# Altium schematic sheet pca10184_nrf54lm20.SchDoc: =ProductName + ' - nRF54LM20 MCU'
size A3; Organization: Nordic Semiconductor; DocumentNumber: 2; SheetNumber: 2; SheetTotal: 9; CompanyName: Nordic Semiconductor; DocumentSize: A3
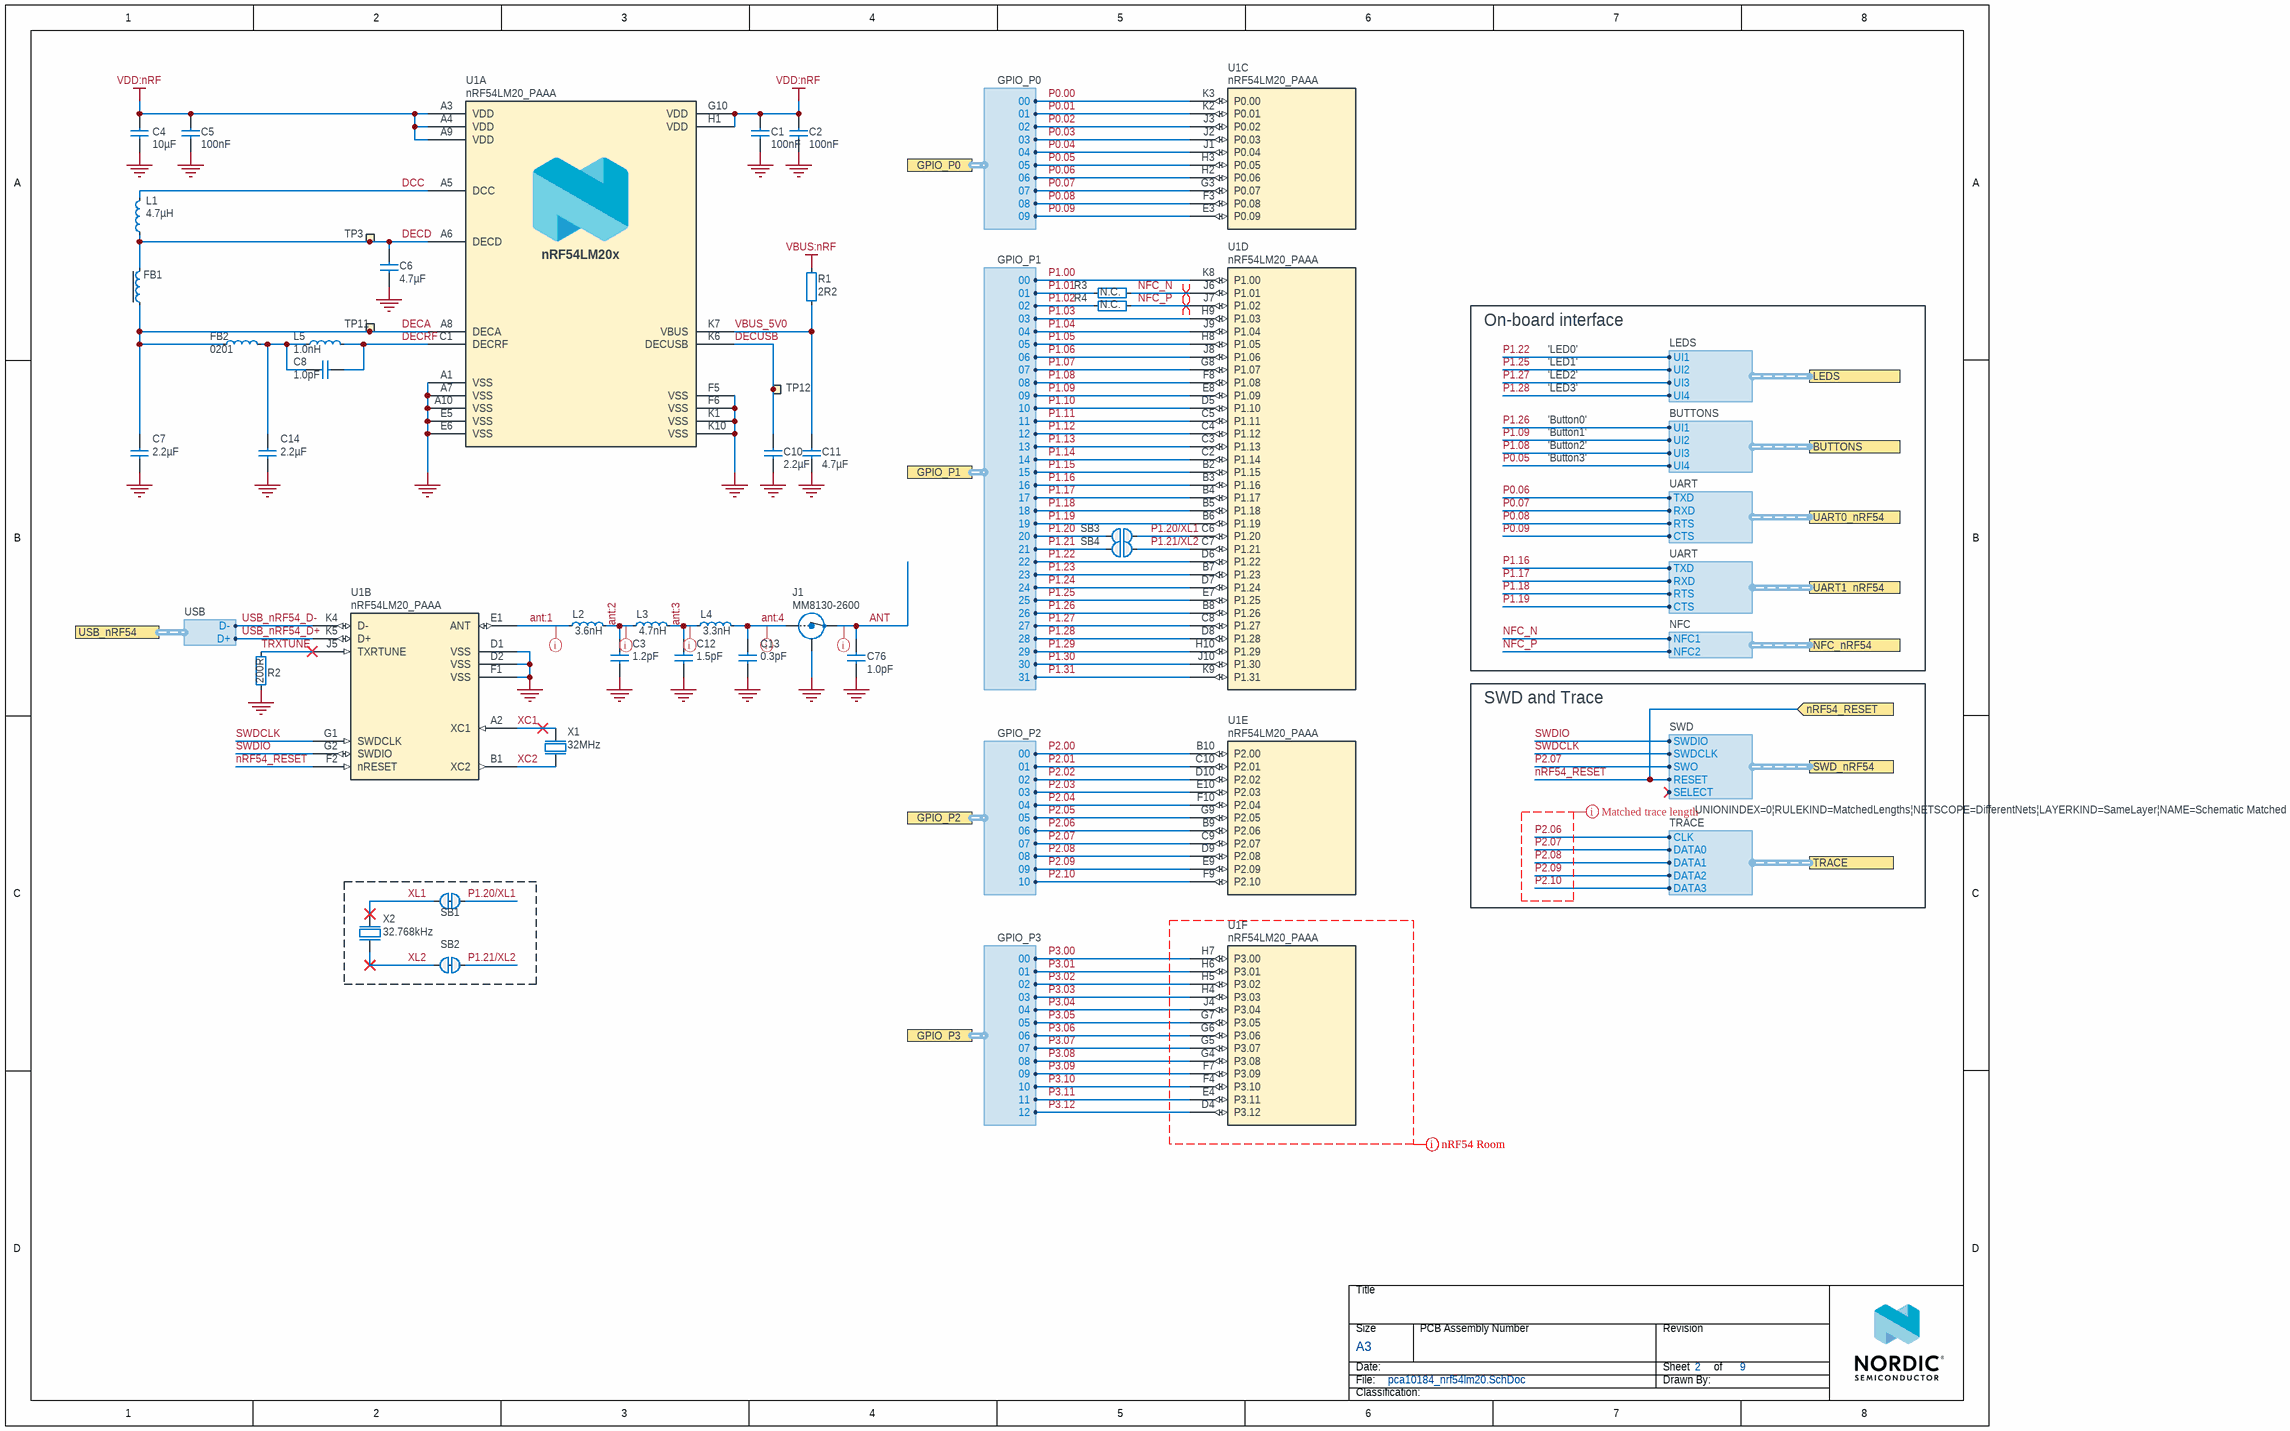
[diagram p0: pca10184_nrf54lm20.SchDoc]

## Parts
C1  100nF  [CAPC0603X03L_C]
C2  100nF  [CAPC0603X03L_C]
C3  1.2pF  [CAPC0603X03L_C]
C4  10µF  [CAPC1005X04L]
C5  100nF  [CAPC0603X03L_C]
C6  4.7µF  [CAPC0603X03L_C]
C7  2.2µF  [CAPC0603X03L_C]
C8  1.0pF  [CAPC0603X03L_C]
C10  2.2µF  [CAPC0603X03L_C]
C11  4.7µF  [CAPC1005X04L]
C12  1.5pF  [CAPC0603X03L_C]
C13  0.3pF  [CAPC0603X03L_C]
C14  2.2µF  [CAPC0603X03L_C]
C76  1.0pF  [CAPC0603X03L_C]
FB1  120R/0.2A  [INDC0603X03L_C]  (value not drawn)
FB2  Footprint Doc: 0201  [INDC0603X03L_C]  (hidden comment: 15nH)
J1  MM8130-2600  [COAXIAL-SWF]
L1  4.7µH  [INDC1608X06L]
L2  3.6nH  [INDC0603X03L_C]
L3  4.7nH  [INDC0603X03L_C]
L4  3.3nH  [INDC0603X03L_C]
L5  1.0nH  [INDC0603X03L_C]
R1  2R2  [RESC1608X06L]
R2  200R  [RESC0603X03L_C]
R3  N.C.  [RESC1005X04L_NC]
R4  N.C.  [RESC1005X04L_NC]
SB1  Solderbridge  [Solderbridge_Shorted]  (value not drawn)  (net tie, no BOM)
SB2  Solderbridge  [Solderbridge_Shorted]  (value not drawn)  (net tie, no BOM)
SB3  Solderbridge  [Solderbridge]  (value not drawn)  (no BOM)
SB4  Solderbridge  [Solderbridge]  (value not drawn)  (no BOM)
TP3  Ø0.7mm,SMD  [TP_SMD_D0.7mm]  (value not drawn)  (no BOM)
TP11  Ø0.7mm,SMD  [TP_SMD_D0.7mm]  (value not drawn)  (no BOM)
TP12  Ø0.7mm,SMD  [TP_SMD_D0.7mm]  (value not drawn)  (no BOM)
U1  nRF54LM20_PAAA  [BGA98C35P10X10_367X385X86]  (parts A,B,C,D,E,F of 6)
X1  32MHz  [BT-XTAL_2016]
X2  32.768kHz  [XTAL_2012]

## Ports
BUTTONS (harness BUTTONS), GPIO_P0 (harness GPIO_P0), GPIO_P1 (harness GPIO_P1), GPIO_P2 (harness GPIO_P2), GPIO_P3 (harness GPIO_P3), LEDS (harness LEDS), NFC_nRF54 (harness NFC), nRF54_RESET (in), SWD_nRF54 (harness SWD), TRACE (harness TRACE), UART0_nRF54 (harness UART), UART1_nRF54 (harness UART), USB_nRF54 (harness USB)

## Harnesses
GPIO_P0: 00, 01, 02, 03, 04, 05, 06, 07, 08, 09
GPIO_P1: 00, 01, 02, 03, 04, 05, 06, 07, 08, 09, 10, 11, 12, 13, 14, 15, 16, 17, 18, 19, 20, 21, 22, 23, 24, 25, 26, 27, 28, 29, 30, 31
GPIO_P2: 00, 01, 02, 03, 04, 05, 06, 07, 08, 09, 10
GPIO_P3: 00, 01, 02, 03, 04, 05, 06, 07, 08, 09, 10, 11, 12
USB: D+, D-
NFC: NFC2, NFC1
UART: RTS, CTS, RXD, TXD
LEDS: UI2, UI1, UI3, UI4
BUTTONS: UI2, UI1, UI3, UI4
SWD: SWDIO, SWDCLK, SWO, RESET, SELECT
TRACE: CLK, DATA0, DATA1, DATA3, DATA2

## Nets
GND: C1.2 C2.2 C3.1 C4.1 C5.2 C6.1 C7.1 C10.1 C11.1 C12.2 C13.1 C14.1 C76.1 J1.2(Shield) R2.1 U1.A1(VSS) U1.A7(VSS) U1.A10(VSS) U1.D1(VSS) U1.D2(VSS) U1.E5(VSS) U1.E6(VSS) U1.F1(VSS) U1.F5(VSS) U1.F6(VSS) U1.K1(VSS) U1.K10(VSS) X1.2(GND) X1.4(GND)
VBUS:nRF: R1.2
VDD:nRF: C1.1 C2.1 C4.2 C5.1 U1.A3(VDD) U1.A4(VDD) U1.A9(VDD) U1.G10(VDD) U1.H1(VDD)
ANT: C76.2 J1.3(OUT)
ant:1: L2.1 U1.E1(ANT)
ant:2: C3.2 L2.2 L3.1
ant:3: C12.1 L3.2 L4.1
ant:4: C13.2 J1.1(IN) L4.2
DCC: L1.1 U1.A5(DCC)
DECA: C7.2 FB1.2 FB2.2 TP11.1 U1.A8(DECA)
DECD: C6.2 FB1.1 L1.2 TP3.1 U1.A6(DECD)
DECRF: C8.1 L5.2 U1.C1(DECRF)
DECUSB: C10.2 TP12.1 U1.K6(DECUSB)
NFC_N: R3.2 U1.J6(P1.01) ; port NFC_nRF54.NFC1
NFC_P: R4.2 U1.J7(P1.02) ; port NFC_nRF54.NFC2
nRF54_RESET: U1.F2(nRESET) ; port nRF54_RESET, port SWD_nRF54.RESET
P0.00: U1.K3(P0.00) ; port GPIO_P0.00
P0.01: U1.K2(P0.01) ; port GPIO_P0.01
P0.02: U1.J3(P0.02) ; port GPIO_P0.02
P0.03: U1.J2(P0.03) ; port GPIO_P0.03
P0.04: U1.J1(P0.04) ; port GPIO_P0.04
P0.05: U1.H3(P0.05) ; port GPIO_P0.05, port BUTTONS.UI4
P0.06: U1.H2(P0.06) ; port GPIO_P0.06, port UART0_nRF54.TXD
P0.07: U1.G3(P0.07) ; port GPIO_P0.07, port UART0_nRF54.RXD
P0.08: U1.F3(P0.08) ; port GPIO_P0.08, port UART0_nRF54.RTS
P0.09: U1.E3(P0.09) ; port GPIO_P0.09, port UART0_nRF54.CTS
P1.00: U1.K8(P1.00) ; port GPIO_P1.00
P1.01: R3.1 ; port GPIO_P1.01
P1.02: R4.1 ; port GPIO_P1.02
P1.03: U1.H9(P1.03) ; port GPIO_P1.03
P1.04: U1.J9(P1.04) ; port GPIO_P1.04
P1.05: U1.H8(P1.05) ; port GPIO_P1.05
P1.06: U1.J8(P1.06) ; port GPIO_P1.06
P1.07: U1.G8(P1.07) ; port GPIO_P1.07
P1.08: U1.F8(P1.08) ; port GPIO_P1.08, port BUTTONS.UI3
P1.09: U1.E8(P1.09) ; port GPIO_P1.09, port BUTTONS.UI2
P1.10: U1.D5(P1.10) ; port GPIO_P1.10
P1.11: U1.C5(P1.11) ; port GPIO_P1.11
P1.12: U1.C4(P1.12) ; port GPIO_P1.12
P1.13: U1.C3(P1.13) ; port GPIO_P1.13
P1.14: U1.C2(P1.14) ; port GPIO_P1.14
P1.15: U1.B2(P1.15) ; port GPIO_P1.15
P1.16: U1.B3(P1.16) ; port GPIO_P1.16, port UART1_nRF54.TXD
P1.17: U1.B4(P1.17) ; port GPIO_P1.17, port UART1_nRF54.RXD
P1.18: U1.B5(P1.18) ; port GPIO_P1.18, port UART1_nRF54.RTS
P1.19: U1.B6(P1.19) ; port GPIO_P1.19, port UART1_nRF54.CTS
P1.20: SB3.2 ; port GPIO_P1.20
P1.20/XL1: SB1.1 SB3.1 U1.C6(P1.20)
P1.21: SB4.2 ; port GPIO_P1.21
P1.21/XL2: SB2.1 SB4.1 U1.C7(P1.21)
P1.22: U1.D6(P1.22) ; port GPIO_P1.22, port LEDS.UI1
P1.23: U1.B7(P1.23) ; port GPIO_P1.23
P1.24: U1.D7(P1.24) ; port GPIO_P1.24
P1.25: U1.E7(P1.25) ; port GPIO_P1.25, port LEDS.UI2
P1.26: U1.B8(P1.26) ; port GPIO_P1.26, port BUTTONS.UI1
P1.27: U1.C8(P1.27) ; port GPIO_P1.27, port LEDS.UI3
P1.28: U1.D8(P1.28) ; port GPIO_P1.28, port LEDS.UI4
P1.29: U1.H10(P1.29) ; port GPIO_P1.29
P1.30: U1.J10(P1.30) ; port GPIO_P1.30
P1.31: U1.K9(P1.31) ; port GPIO_P1.31
P2.00: U1.B10(P2.00) ; port GPIO_P2.00
P2.01: U1.C10(P2.01) ; port GPIO_P2.01
P2.02: U1.D10(P2.02) ; port GPIO_P2.02
P2.03: U1.E10(P2.03) ; port GPIO_P2.03
P2.04: U1.F10(P2.04) ; port GPIO_P2.04
P2.05: U1.G9(P2.05) ; port GPIO_P2.05
P2.06: U1.B9(P2.06) ; port GPIO_P2.06, port TRACE.CLK
P2.07: U1.C9(P2.07) ; port GPIO_P2.07, port SWD_nRF54.SWO, port TRACE.DATA0
P2.08: U1.D9(P2.08) ; port GPIO_P2.08, port TRACE.DATA1
P2.09: U1.E9(P2.09) ; port GPIO_P2.09, port TRACE.DATA2
P2.10: U1.F9(P2.10) ; port GPIO_P2.10, port TRACE.DATA3
P3.00: U1.H7(P3.00) ; port GPIO_P3.00
P3.01: U1.H6(P3.01) ; port GPIO_P3.01
P3.02: U1.H5(P3.02) ; port GPIO_P3.02
P3.03: U1.H4(P3.03) ; port GPIO_P3.03
P3.04: U1.J4(P3.04) ; port GPIO_P3.04
P3.05: U1.G7(P3.05) ; port GPIO_P3.05
P3.06: U1.G6(P3.06) ; port GPIO_P3.06
P3.07: U1.G5(P3.07) ; port GPIO_P3.07
P3.08: U1.G4(P3.08) ; port GPIO_P3.08
P3.09: U1.F7(P3.09) ; port GPIO_P3.09
P3.10: U1.F4(P3.10) ; port GPIO_P3.10
P3.11: U1.E4(P3.11) ; port GPIO_P3.11
P3.12: U1.D4(P3.12) ; port GPIO_P3.12
SWDCLK: U1.G1(SWDCLK) ; port SWD_nRF54.SWDCLK
SWDIO: U1.G2(SWDIO) ; port SWD_nRF54.SWDIO
TRXTUNE: R2.2 U1.J5(TXRTUNE)
USB_nRF54_D+: U1.K5(D+) ; port USB_nRF54.D+
USB_nRF54_D-: U1.K4(D-) ; port USB_nRF54.D-
VBUS_5V0: C11.2 R1.1 U1.K7(VBUS)
XC1: U1.A2(XC1) X1.1(inp)
XC2: U1.B1(XC2) X1.3(out)
XL1: SB1.2 X2.2(out)
XL2: SB2.2 X2.1(inp)
NetC8_2: C8.2 C14.2 FB2.1 L5.1

## Layout directives
differential pair; differential pair class NFC: NFC_N, NFC_P
net class TRACE; rule Matched Net Lengths [Delay Tolerance = 500ps]: P2.06, P2.07, P2.08, P2.09, P2.10
net class RF: ANT, ant:1, ant:2, ant:3, ant:4
CompClassName: nRF54: (no net found under the mark)

## Notes on the sheet
- On-board interface
- 'LED0'
- 'LED1'
- 'LED2'
- 'LED3'
- 'Button0'
- 'Button1'
- 'Button2'
- 'Button3'
- SWD and Trace
- Title
- Size
- Date:
- File:
- A3
- PCB Assembly Number
- Sheet
- Drawn By:
- Revision
- of
- Classification:
- (in symbol nRF54LM20-PAAA, part A) nRF54LM20x

## Library data of the parts
C1 C2 C5 = C0201-100n-10V-X7R: Capacitor, X7R, ±10%, 10V; Manufacturer: N.A.; Part number NEMS: 100200469; Pad Count: 2; Component Status: Active; Part Number: C0201-100n-10V-X7R; Manufacturer Part Number: N.A.; Footprint Doc: 0201; LatestRevisionDate: 2024-09-18; Published: 2021-04-12; Value: 100nF; Note: 10V; Artikkelnr Noca: N.A.; Part number IPS: N.A.; ComponentLink1URL: N.A.; ComponentLink1Description: Datasheet; ComponentLink2URL: N.A.; ComponentLink2Description: Supplier link; HelpURL: N.A.; Supplier 1: N.A.; Supplier Part Number 1: N.A.; Supplier 2: N.A.; Supplier Part Number 2: N.A.; Component Class: Capacitors; Author: getr; Part number Norautron: N.A.; PartId: 100200469
C3 = C0201-1.2p-HQ-Murata: Capacitor, NP0, ±0.05pF, 50V; Manufacturer: Murata; Manufacturer Part Number: GJM0335C1H1R2WB01D; Part number NEMS: 100200457; Component Status: Active; Pad Count: 2; Artikkelnr Noca: N.A.; Part Number: C0201-1.2p-HQ-Murata; Component Class: Capacitors; Author: rsk; ComponentLink1URL: https://search.murata.co.jp/Ceramy/image/img/A01X/G101/ENG/GJM0335C1H1R2WB01-01.pdf; ComponentLink1Description: Datasheet; ComponentLink2URL: https://www.murata.com/en-global/products/productdetail?partno=GJM0335C1H1R2WB01%23; ComponentLink2Description: Supplier link; HelpURL: N.A.; LatestRevisionDate: 2020-12-16; Published: 2020-12-16; Footprint Doc: 0201; Value: 1.2pF; Note: 50V; Supplier 1: DigiKey; Supplier Part Number 1: 490-GJM0335C1H1R2WB01DCT-ND; Supplier 2: Mouser; Supplier Part Number 2: 81-GJM0335C1H1R2WB1D; Part number IPS: N.A.; Part number Norautron: N.A.; PartId: 100200457
C4 = C0402-10µF-6.3V-X6S: Capacitor, X6S, ±20%, 6.3V; Manufacturer: N.A.; Part number NEMS: 100200478; Component Status: Active; Pad Count: 2; Part Number: C0402-10µF-6.3V-X6S; PartId: 100200478; Component Class: Capacitors; Author: getr; Manufacturer Part Number: N.A.; ComponentLink1URL: N.A.; ComponentLink1Description: Datasheet; ComponentLink2URL: N.A.; ComponentLink2Description: Supplier link; HelpURL: N.A.; LatestRevisionDate: 2021-06-25; Published: 2021-06-25; Footprint Doc: 0402; Value: 10µF; Note: 6.3V; Supplier 1: N.A.; Supplier Part Number 1: N.A.; Supplier 2: N.A.; Supplier Part Number 2: N.A.; Artikkelnr Noca: N.A.; Part number IPS: N.A.; Part number Norautron: N.A.
C6 = C0201-4.7µ-6V3-X5R-GRM035R60J475ME15J: Capacitor, Ceramic, X5R, ±20%, 6.3V; Manufacturer: Murata; Part number NEMS: 100200685; Component Status: Active; Pad Count: 2; Note: -55°C ~ 85°C; Artikkelnr Noca: N.A.; Part Number: C0201-4.7µ-6V3-X5R-GRM035R60J475ME15J; Component Class: Capacitors; Author: rsk; Manufacturer Part Number: GRM035R60J475ME15J; ComponentLink1URL: https://search.murata.co.jp/Ceramy/image/img/A01X/G101/ENG/GRM035R60J475ME15-01A.pdf; ComponentLink1Description: Datasheet; ComponentLink2URL: https://www.digikey.no/en/products/detail/murata-electronics/GRM035R60J475ME15J/10699045; ComponentLink2Description: Supplier link; HelpURL: https://www.murata.com/en-eu/products/productdetail?partno=GRM035R60J475ME15J; LatestRevisionDate: 2025-03-04; Published: 2025-03-04; Footprint Doc: 0201; Value: 4.7µF; Supplier 1: DigiKey; Supplier Part Number 1: 490-GRM035R60J475ME15JDKR-ND; Supplier 2: Mouser; Supplier Part Number 2: 81-GRM035R60J475ME5J; Part number IPS: N.A.; Part number Norautron: N.A.; PartId: 100200685
C7 C14 = C0201-2µ2-2.5V-X6T-GRM033D80E225ME47D: Capacitor, Ceramic, 2.2µF 2.5V X6T 0201,±20%; Manufacturer: Murata; Part number NEMS: 100200527; Component Status: Active; Pad Count: 2; Note: 2.5V, 20%, X6T; Artikkelnr Noca: N.A.; Part Number: C0201-2µ2-2.5V-X6T-GRM033D80E225ME47D; Component Class: Capacitors; Author: stl1; Manufacturer Part Number: GRM033D80E225ME47D; ComponentLink1URL: https://www.murata.com/products/productdetail?partno=GRM033D80E225ME47%23; ComponentLink1Description: Datasheet; ComponentLink2URL: N.A.; ComponentLink2Description: Supplier link; HelpURL: N.A.; LatestRevisionDate: 2022-02-27; Published: 2022-02-27; Footprint Doc: 0201; Value: 2.2µF; Supplier 1: Mouser; Supplier Part Number 1: 81-GRM033D80E225ME7D; Supplier 2: DigiKey; Supplier Part Number 2: 490-18653-1-ND; Part number IPS: N.A.; Part number Norautron: N.A.; PartId: 100200527
C8 = C0201-1p0-25V-COG-GJM0335C1E1R0WB01: CAP CER 1.0PF 25V C0G/NP0 0201; Manufacturer: Murata; Part number NEMS: 100200676; Component Status: Active; Pad Count: 2; Artikkelnr Noca: N.A.; Part Number: C0201-1p0-25V-COG-GJM0335C1E1R0WB01; Component Class: Capacitors; Author: masi; Manufacturer Part Number: GJM0335C1E1R0WB01; ComponentLink1URL: https://search.murata.co.jp/Ceramy/image/img/A01X/G101/ENG/GJM0335C1E1R0WB01-01A.pdf; ComponentLink1Description: Datasheet; ComponentLink2URL: https://www.digikey.no/en/products/detail/murata-electronics/GRM0335C1E101JA01D/702426?s=N4IgTCBcDaICwE4AMBaAzARgGyqygcgCIgC6AvkA; ComponentLink2Description: Supplier link; HelpURL: N.A.; LatestRevisionDate: 2024-10-17; Published: 2024-10-17; Footprint Doc: 0201; Value: 1.0pF; Note: 25V; Supplier 1: DigiKey; Supplier Part Number 1: 490-10677-1-ND; Supplier 2: Mouser; Supplier Part Number 2: 81-GJM0335C1E1R0WB01; Part number IPS: N.A.; Part number Norautron: N.A.; PartId: 100200676
C10 = C0201-2µ2-10V-X5R-GRM033R61A225KE47: Capacitor, Ceramic, 2.2µF 10V X5R 0201,±10%; Manufacturer: Murata; Manufacturer Part Number: GRM033R61A225KE47D; Part number NEMS: 100200496; Component Status: Active; Pad Count: 2; Artikkelnr Noca: N.A.; Part Number: C0201-2µ2-10V-X5R-GRM033R61A225KE47; Component Class: Capacitors; Author: prbu; ComponentLink1URL: https://www.murata.com/en-sg/products/productdetail?partno=GRM033R61A225KE47%23; ComponentLink1Description: Datasheet; ComponentLink2URL: https://www.mouser.com/ProductDetail/Murata-Electronics/GRM033R61A225KE47D?qs=I53XXhTNm8tqgHaFsI1bug%3D%3D; ComponentLink2Description: Supplier link; HelpURL: N.A.; LatestRevisionDate: 2021-12-09; Published: 2021-12-09; Footprint Doc: 0201; Value: 2.2µF; Note: 10V; Supplier 1: Mouser; Supplier Part Number 1: 81-GRM033R61A225KE7D; Supplier 2: Digi-Key; Supplier Part Number 2: 490-13227-1-ND; Part number IPS: N.A.; Part number Norautron: N.A.; PartId: 100200496
C11 = C0402-4µ7-10V-X5R: Capacitor, X5R, 10V; Manufacturer: Murata; Manufacturer Part Number: GRM155R61A475MEAAD; Part number NEMS: 100200415; Component Status: Active; Pad Count: 2; Artikkelnr Noca: N.A.; Part Number: C0402-4µ7-10V-X5R; PartId: 100200415; Component Class: Capacitors; Author: rsk; ComponentLink1URL: http://search.murata.co.jp/Ceramy/image/img/A01X/G101/ENG/GRM155R61A475MEAA-01.pdf; ComponentLink1Description: Datasheet; ComponentLink2URL: https://www.digikey.com/product-detail/en/murata-electronics-north-america/GRM155R61A475MEAAD/490-14306-1-ND/6234742; ComponentLink2Description: Supplier link; HelpURL: https://psearch.en.murata.com/capacitor/product/GRM155R61A475MEAA%23.html; LatestRevisionDate: 2020-10-13; Published: 2018-10-04; Footprint Doc: 0402; Value: 4.7µF; Note: 10V; Supplier 1: Digi-Key; Supplier Part Number 1: 490-14306-1-ND; Supplier 2: N.A.; Supplier Part Number 2: N.A.; Part number IPS: N.A.; Part number Norautron: N.A.
C12 = C0201-1.5p-25V-NP0-GJM0335C1E1R5WB01: Capacitor, NP0, ±0.05pF, 25V, High Q; Manufacturer: Murata; Part number NEMS: 100200477; Component Status: Active; Pad Count: 2; Artikkelnr Noca: N.A.; Part Number: C0201-1.5p-25V-NP0-GJM0335C1E1R5WB01; Component Class: Capacitors; Author: masi; Manufacturer Part Number: GJM0335C1E1R5WB01; ComponentLink1URL: https://search.murata.co.jp/Ceramy/image/img/A01X/G101/ENG/GJM0335C1E1R5WB01-01.pdf; ComponentLink1Description: Datasheet; ComponentLink2URL: N.A.; ComponentLink2Description: Supplier link; HelpURL: https://www.murata.com/products/productdetail?partno=GJM0335C1E1R5WB01%23; LatestRevisionDate: 2021-06-15; Published: 2021-06-15; Footprint Doc: 0201; Value: 1.5pF; Note: 25V; Supplier 1: DigiKey; Supplier Part Number 1: 490-11176-2-ND; Supplier 2: Mouser; Supplier Part Number 2: 81-GJM0335C1E1R5WB1D; Part number IPS: N.A.; Part number Norautron: N.A.; PartId: 100200477
C13 = C0201-0.3p-50V-GRM0335C1HR30BA01: Capacitor, C0G, ±0.1pF, 50V; Manufacturer: Murata; Part number NEMS: 100200650; Component Status: Active; Pad Count: 2; Artikkelnr Noca: N.A.; Part Number: C0201-0.3p-50V-GRM0335C1HR30BA01; PartId: 100200650; Component Class: Capacitors; Author: masi; Manufacturer Part Number: GRM0335C1HR30BA01; ComponentLink1URL: https://www.murata.com/en-global/products/productdetail?partno=GRM0335C1HR30BA01%23; ComponentLink1Description: Datasheet; ComponentLink2URL: N.A.; ComponentLink2Description: Supplier link; HelpURL: N.A.; LatestRevisionDate: 2024-01-10; Published: 2024-01-10; Footprint Doc: 0201; Value: 0.3pF; Note: 50V; Supplier 1: DigiKey; Supplier Part Number 1: 490-6135-2-ND; Supplier 2: Mouser; Supplier Part Number 2: 81-GRM0335C1HR30BA1D; Part number IPS: N.A.; Part number Norautron: N.A.
C76 = C0201-1.0p_RF: RF Chip Cap 0201; Manufacturer: N.A.; Part number NEMS: 100200085; Pad Count: 2; Note: High frequency chip capasitors ±5%, NP0; Component Status: Active; Part Number: C0201-1.0p_RF; PartId: 100200085; Component Class: Capacitors; Author: rsk; Manufacturer Part Number: N.A.; ComponentLink1URL: N.A.; ComponentLink1Description: Datasheet; ComponentLink2URL: N.A.; ComponentLink2Description: Supplier link; HelpURL: N.A.; Footprint Doc: 0201; LatestRevisionDate: 2016-04-22; Published: 2016-04-22; Value: 1.0pF; Supplier 1: N.A.; Supplier Part Number 1: N.A.; Supplier 2: N.A.; Supplier Part Number 2: N.A.; Artikkelnr Noca: N.A.; Part number IPS: N.A.; Part number Norautron: N.A.
FB1 = FB0201-120R@100M-200mA-BLM03AG121SN1D: Ferrite Bead, 120 Ohm @ 100MHz, 200mA, 500 mOhm Max; Manufacturer: Murata; Part number NEMS: 100300419; Component Status: Active; Pad Count: 2; Artikkelnr Noca: N.A.; Part Number: FB0201-120R@100M-200mA-BLM03AG121SN1D; Component Class: Inductors; Author: stl1; Manufacturer Part Number: BLM03AG121SN1D; ComponentLink1URL: https://www.murata.com/en-eu/products/productdetail?partno=BLM03AG121SN1%23; ComponentLink1Description: Datasheet; ComponentLink2URL: N.A.; ComponentLink2Description: Supplier link; HelpURL: N.A.; LatestRevisionDate: 2022-02-27; Published: 2022-02-27; Footprint Doc: 0201; Value: 120R/0.2A; Note: Ferrite Bead; Supplier 1: Digi-Key; Supplier Part Number 1: 490-5622-1-ND; Supplier 2: Mouser; Supplier Part Number 2: 81-BLM03AX121SN1D; Part number IPS: N.A.; Part number Norautron: N.A.; PartId: 100300419
FB2 = L0201-15n: Inductor, 250mA, ±5%; Manufacturer: Murata; Manufacturer Part Number: LQP03TN15NJ02D; Part number NEMS: 100300032; Component Status: Active; Pad Count: 2; Note: High frequency chip inductor ±10%; Artikkelnr Noca: N.A.; Part Number: L0201-15n; Component Class: Inductors; Author: rsk; ComponentLink1URL: http://search.murata.co.jp/Ceramy/image/img/P02/JELF243C-0015.pdf; ComponentLink1Description: Datasheet; ComponentLink2URL: N.A.; ComponentLink2Description: Supplier link; HelpURL: N.A.; LatestRevisionDate: 2013-04-10; Published: 2013-04-10; Value: 15nH; Supplier 1: DigiKey; Supplier Part Number 1: 490-5570-1-ND; Supplier 2: N.A.; Supplier Part Number 2: N.A.; Part number IPS: N.A.; Part number Norautron: N.A.; PartId: 100300032
J1 = MM8130-2600: Coaxial Connector with Switch; Manufacturer: Murata; Part number IPS: 00000009955; Part number Norautron: 26030338; Part number NEMS: 100500400; Note: N.A.; Artikkelnr Noca: 55029011; Pad Count: 3; Component Status: Active; Part Number: MM8130-2600; Manufacturer Part Number: MM8130-2600; LatestRevisionDate: 2014-04-24; Published: 2014-04-24; Value: MM8130-2600; Footprint Doc: COAXIAL-SWF; ComponentLink1URL: N.A.; ComponentLink1Description: Datasheet; ComponentLink2URL: N.A.; ComponentLink2Description: Supplier link; HelpURL: http://www.murata.com/products/catalog/pdf/o33e.pdf; Supplier 1: Digi-Key; Supplier Part Number 1: 490-4981-1-ND; Supplier 2: Mouser; Supplier Part Number 2: 81-MM8130-2600RA2; Component Class: Connectors; PartId: 100500400; Author: rsk; System: Connector
L1 = L0603-4µ7-MLZ1608M4R7WT000: Inductor, 120mA, ±20%, 0.65R; Manufacturer: TDK Corporation; Part number NEMS: 100300440; Component Status: Active; Pad Count: 2; Note: Power Inductor ±20%; Artikkelnr Noca: N.A.; Part Number: L0603-4µ7-MLZ1608M4R7WT000; PartId: 100300440; Component Class: Inductors; Author: stl1; Manufacturer Part Number: MLZ1608M4R7WT000; ComponentLink1URL: https://product.tdk.com/en/search/inductor/inductor/smd/info?part_no=MLZ1608M4R7WT000; ComponentLink1Description: Datasheet; ComponentLink2URL: N.A.; ComponentLink2Description: Supplier link; HelpURL: N.A.; LatestRevisionDate: 2023-05-10; Published: 2023-05-10; Footprint Doc: 0603; Value: 4.7µH; Supplier 1: Digi-Key; Supplier Part Number 1: 445-6390-2-ND; Supplier 2: Mouser; Supplier Part Number 2: 810-MLZ1608M4R7WT000; Part number IPS: N.A.; Part number Norautron: N.A.
L2 = L0201-3n6-HQ-Murata: Inductor, 500mA, ±0.1ｎH, 170mOhm; Manufacturer: Murata; Manufacturer Part Number: LQP03HQ3N6B02; Part number NEMS: 100300223; Component Status: Active; Pad Count: 2; Note: -55°C ~ 125°C; Artikkelnr Noca: N.A.; Part Number: L0201-3n6-HQ-Murata; PartId: 100300223; Component Class: Inductors; Author: rsk; ComponentLink1URL: https://search.murata.co.jp/Ceramy/image/img/P02/JELF243C-0021.pdf; ComponentLink1Description: Datasheet; ComponentLink2URL: N.A.; ComponentLink2Description: Supplier link; HelpURL: https://psearch.en.murata.com/inductor/product/LQP03HQ3N6B02%23.html; LatestRevisionDate: 2018-10-23; Published: 2018-10-23; Footprint Doc: 0201; Value: 3.6nH; Supplier 1: DigiKey; Supplier Part Number 1: 490-13927-1-ND; Supplier 2: N.A.; Supplier Part Number 2: N.A.; Part number IPS: N.A.; Part number Norautron: N.A.
L3 = L0201-4n7-HQ-Murata: Inductor, 400mA, ±3%, 250mOhm; Manufacturer: Murata; Manufacturer Part Number: LQP03HQ4N7H02; Part number NEMS: 100300231; Component Status: Active; Pad Count: 2; Note: -55°C ~ 125°C; Artikkelnr Noca: N.A.; Part Number: L0201-4n7-HQ-Murata; Component Class: Inductors; Author: rsk; ComponentLink1URL: https://search.murata.co.jp/Ceramy/image/img/P02/JELF243C-0021.pdf; ComponentLink1Description: Datasheet; ComponentLink2URL: N.A.; ComponentLink2Description: Supplier link; HelpURL: https://psearch.en.murata.com/inductor/product/LQP03HQ4N7H02%23.html; LatestRevisionDate: 2018-10-23; Published: 2018-10-23; Footprint Doc: 0201; Value: 4.7nH; Supplier 1: DigiKey; Supplier Part Number 1: 490-13943-1-ND; Supplier 2: N.A.; Supplier Part Number 2: N.A.; Part number IPS: N.A.; Part number Norautron: N.A.; PartId: 100300231
L4 = L0201-3n3-HQ-Murata: Inductor, 500mA, ±0.1ｎH, 170mOhm; Manufacturer: Murata; Manufacturer Part Number: LQP03HQ3N3B02; Part number NEMS: 100300220; Component Status: Active; Pad Count: 2; Note: -55°C ~ 125°C; Artikkelnr Noca: N.A.; Part Number: L0201-3n3-HQ-Murata; Component Class: Inductors; Author: rsk; ComponentLink1URL: https://search.murata.co.jp/Ceramy/image/img/P02/JELF243C-0021.pdf; ComponentLink1Description: Datasheet; ComponentLink2URL: N.A.; ComponentLink2Description: Supplier link; HelpURL: https://psearch.en.murata.com/inductor/product/LQP03HQ3N3B02%23.html; LatestRevisionDate: 2018-10-23; Published: 2018-10-23; Footprint Doc: 0201; Value: 3.3nH; Supplier 1: DigiKey; Supplier Part Number 1: 490-13921-1-ND; Supplier 2: N.A.; Supplier Part Number 2: N.A.; Part number IPS: N.A.; Part number Norautron: N.A.; PartId: 100300220
L5 = L0201-1n0: Inductor, 750mA, ±0.2nH; Manufacturer: Murata; Manufacturer Part Number: LQP03TN1N0C02D; Part number NEMS: 100300012; Component Status: Active; Pad Count: 2; Note: High frequency chip inductor ±5%; Artikkelnr Noca: N.A.; Part Number: L0201-1n0; PartId: 100300012; Component Class: Inductors; Author: rsk; ComponentLink1URL: http://search.murata.co.jp/Ceramy/image/img/P02/JELF243C-0015.pdf; ComponentLink1Description: Datasheet; ComponentLink2URL: N.A.; ComponentLink2Description: Supplier link; HelpURL: N.A.; LatestRevisionDate: 2013-04-10; Published: 2013-04-10; Footprint Doc: 0201; Value: 1.0nH; Supplier 1: DigiKey; Supplier Part Number 1: 490-5546-1-ND; Supplier 2: N.A.; Supplier Part Number 2: N.A.; Part number IPS: N.A.; Part number Norautron: N.A.
R1 = R0603-2R2: RES 2.2 OHM 1% 1/10W 0603; Manufacturer: N.A.; Part number NEMS: 100100736; Component Status: Active; Pad Count: 2; Note: Chip Res 1%; Part Number: R0603-2R2; Component Class: Resistors; Author: getr; Manufacturer Part Number: N.A.; ComponentLink1URL: N.A.; ComponentLink1Description: Datasheet; ComponentLink2URL: N.A.; ComponentLink2Description: Supplier link; HelpURL: N.A.; LatestRevisionDate: 2025-05-14; Published: 2025-05-14; Footprint Doc: 0603; Value: 2R2; Supplier 1: N.A.; Supplier Part Number 1: N.A.; Supplier 2: N.A.; Supplier Part Number 2: N.A.; Artikkelnr Noca: N.A.; Part number IPS: N.A.; Part number Norautron: N.A.; PartId: 100100736
R2 = R0201-200: Resistor, ±1%, 0.05W; Manufacturer: N.A.; Part number NEMS: 100100611; Component Status: Active; Pad Count: 2; Note: Chip Res 1%; Part Number: R0201-200; PartId: 100100611; Component Class: Resistors; Author: getr; Manufacturer Part Number: N.A.; ComponentLink1URL: N.A.; ComponentLink1Description: Datasheet; ComponentLink2URL: N.A.; ComponentLink2Description: Supplier link; HelpURL: N.A.; LatestRevisionDate: 2021-04-08; Published: 2021-04-08; Footprint Doc: 0201; Value: 200R; Supplier 1: N.A.; Supplier Part Number 1: N.A.; Supplier 2: N.A.; Supplier Part Number 2: N.A.; Artikkelnr Noca: N.A.; Part number IPS: N.A.; Part number Norautron: N.A.
R3 R4 = R0402-N.C.: Not mounted; Manufacturer: N.A.; Part number NEMS: 100100281; Component Status: Active; Pad Count: 2; Note: Chip Res; Assembly: Not mounted; Part Number: R0402-N.C.; PartId: 100100281; Component Class: Resistors; Author: rsk; Manufacturer Part Number: N.A.; ComponentLink1URL: N.A.; ComponentLink1Description: Datasheet; ComponentLink2URL: N.A.; ComponentLink2Description: Supplier link; HelpURL: N.A.; LatestRevisionDate: 2009-05-08; Published: 2009-05-08; Footprint Doc: 0402; Value: N.C.; Supplier 1: N.A.; Supplier Part Number 1: N.A.; Supplier 2: N.A.; Supplier Part Number 2: N.A.; Artikkelnr Noca: N.A.; Part number IPS: N.A.; Part number Norautron: N.A.
SB1 SB2 = Solderbridge Shorted: Shorted Solderbridge; Manufacturer: N.A.; Part number NEMS: 100500459; Pad Count: 2; Component Status: Active; System: Connector; Part Number: Solderbridge Shorted; Manufacturer Part Number: N.A.; LatestRevisionDate: 2012-08-07; Published: 2012-08-07; Value: Solderbridge; Note: N.A.; Artikkelnr Noca: N.A.; Footprint Doc: Solderbridge_Shorted; Part number IPS: N.A.; ComponentLink1URL: N.A.; ComponentLink1Description: Datasheet; ComponentLink2URL: N.A.; ComponentLink2Description: Supplier link; HelpURL: N.A.; Supplier 1: N.A.; Supplier Part Number 1: N.A.; Supplier 2: N.A.; Supplier Part Number 2: N.A.; Component Class: Connectors; PartId: 100500459; Author: rsk; Part number Norautron: N.A.
SB3 SB4 = Solderbridge: Manufacturer: N.A.; Part number NEMS: 100500458; Pad Count: 2; Component Status: Active; System: Connector; Part Number: Solderbridge; Manufacturer Part Number: N.A.; LatestRevisionDate: 2009-12-14; Published: 2009-12-14; Value: Solderbridge; Note: N.A.; Artikkelnr Noca: N.A.; Footprint Doc: Solderbridge; Part number IPS: N.A.; ComponentLink1URL: N.A.; ComponentLink1Description: Datasheet; ComponentLink2URL: N.A.; ComponentLink2Description: Supplier link; HelpURL: N.A.; Supplier 1: N.A.; Supplier Part Number 1: N.A.; Supplier 2: N.A.; Supplier Part Number 2: N.A.; Component Class: Connectors; PartId: 100500458; Author: rsk; Part number Norautron: N.A.
TP3 TP11 TP12 = TP_SMD_Ø0.7MM: 0.7mm circular SMD testpad; Manufacturer: Nordic Semiconductor; Manufacturer Part Number: N.A.; Part number NEMS: 100500474; Pad Count: 1; Component Status: Active; Part Number: TP_SMD_Ø0.7MM; ComponentLink1URL: N.A.; ComponentLink1Description: Datasheet; ComponentLink2URL: N.A.; ComponentLink2Description: Supplier link; HelpURL: N.A.; Footprint Doc: TP_SMD_Ø0.7mm; LatestRevisionDate: 2021-03-05; Published: 2017-12-14; Value: Ø0.7mm,SMD; Note: N.A.; Supplier 1: N.A.; Supplier Part Number 1: N.A.; Supplier 2: N.A.; Supplier Part Number 2: N.A.; Artikkelnr Noca: N.A.; Part number IPS: N.A.; Component Class: Connectors; PartId: 100500474; Author: rsk; Part number Norautron: N.A.
U1 = nRF54LM20-PAAA: nRF54 series BLE; Manufacturer: Nordic Semiconductor; Part number NEMS: 102000394; Component Status: Active; Pad Count: 98; Note: N.A.; Part Number: nRF54LM20-PAAA; PartId: 102000394; Component Class: Nordic_Devices; Author: getr; Manufacturer Part Number: nRF54LM20_PAAA; ComponentLink1URL: N.A.; ComponentLink1Description: Datasheet; ComponentLink2URL: N.A.; ComponentLink2Description: Supplier link; HelpURL: N.A.; LatestRevisionDate: 2025-02-26; Published: 2025-02-26; Footprint Doc: FCCSP-98; Value: nRF54LM20_PAAA; Supplier 1: Nordic Semiconductor; Supplier Part Number 1: nRF54LM20_PAAA; Supplier 2: N.A.; Supplier Part Number 2: N.A.; Artikkelnr Noca: N.A.; Part number IPS: N.A.; Part number Norautron: N.A.
X1 = XTAL_SMD2016_32MHz_8pF_Kyocera: XTAL SMD 2016, 32MHz, Cl=8pF, Tot: ±40ppm; Manufacturer Part Number: CX2016DB32000D0WZRC1; Part number IPS: 00000007827; Part number Norautron: 26511136; Part number NEMS: 101600039; Component Status: Active; Pad Count: 4; Note: XTAL SMD 32.000MHz; Artikkelnr Noca: 22010022; Part Number: XTAL_SMD2016_32MHz_8pF_Kyocera; PartId: 101600039; Component Class: Oscillators; Author: rsk; Manufacturer: Kyocera; ComponentLink1URL: N.A.; ComponentLink1Description: Datasheet; ComponentLink2URL: N.A.; ComponentLink2Description: Supplier link; HelpURL: http://media.digikey.com/pdf/Data%20Sheets/AVX%20PDFs/CX2016DB32000D0WZRC1_Spec.pdf; LatestRevisionDate: 2016-06-02; Published: 2015-10-15; Footprint Doc: XTAL_2016; Value: 32MHz; Supplier 1: Digi-Key; Supplier Part Number 1: 1253-1586-1-ND; Supplier 2: N.A.; Supplier Part Number 2: N.A.
X2 = XTAL_SMD2012_32.768kHz_9pF_TXC: XTAL SMD 2012, 32.768kHz, 9pF, ±20ppm; Manufacturer: TXC Corporation; Manufacturer Part Number: 9HT11-32.768KDZC-T; Part number NEMS: 101600107; Component Status: Active; Pad Count: 2; Note: XTAL SMD 32.768kHz; Artikkelnr Noca: N.A.; Part Number: XTAL_SMD2012_32.768kHz_9pF_TXC; PartId: 101600107; Component Class: Oscillators; Author: eisk; ComponentLink1URL: http://www.txccrystal.com/images/pdf/9ht11.pdf; ComponentLink1Description: Datasheet; ComponentLink2URL: https://www.digikey.com/en/products/detail/9HT11-32.768KDZC-T/887-1426-1-ND/2403277; ComponentLink2Description: Supplier link; HelpURL: http://www.txccrystal.com/images/pdf/9ht11.pdf; LatestRevisionDate: 2023-03-14; Published: 2014-03-28; Footprint Doc: XTAL_2012; Value: 32.768kHz; Supplier 1: Digi-Key; Supplier Part Number 1: 887-1426-2-ND; Supplier 2: Mouser; Supplier Part Number 2: 717-9HT11-32.7KDZC-T; Part number IPS: N.A.; Part number Norautron: N.A.